# EAGLE design HbHandBoardMk2_V4 (EAGLE 8.3.2)
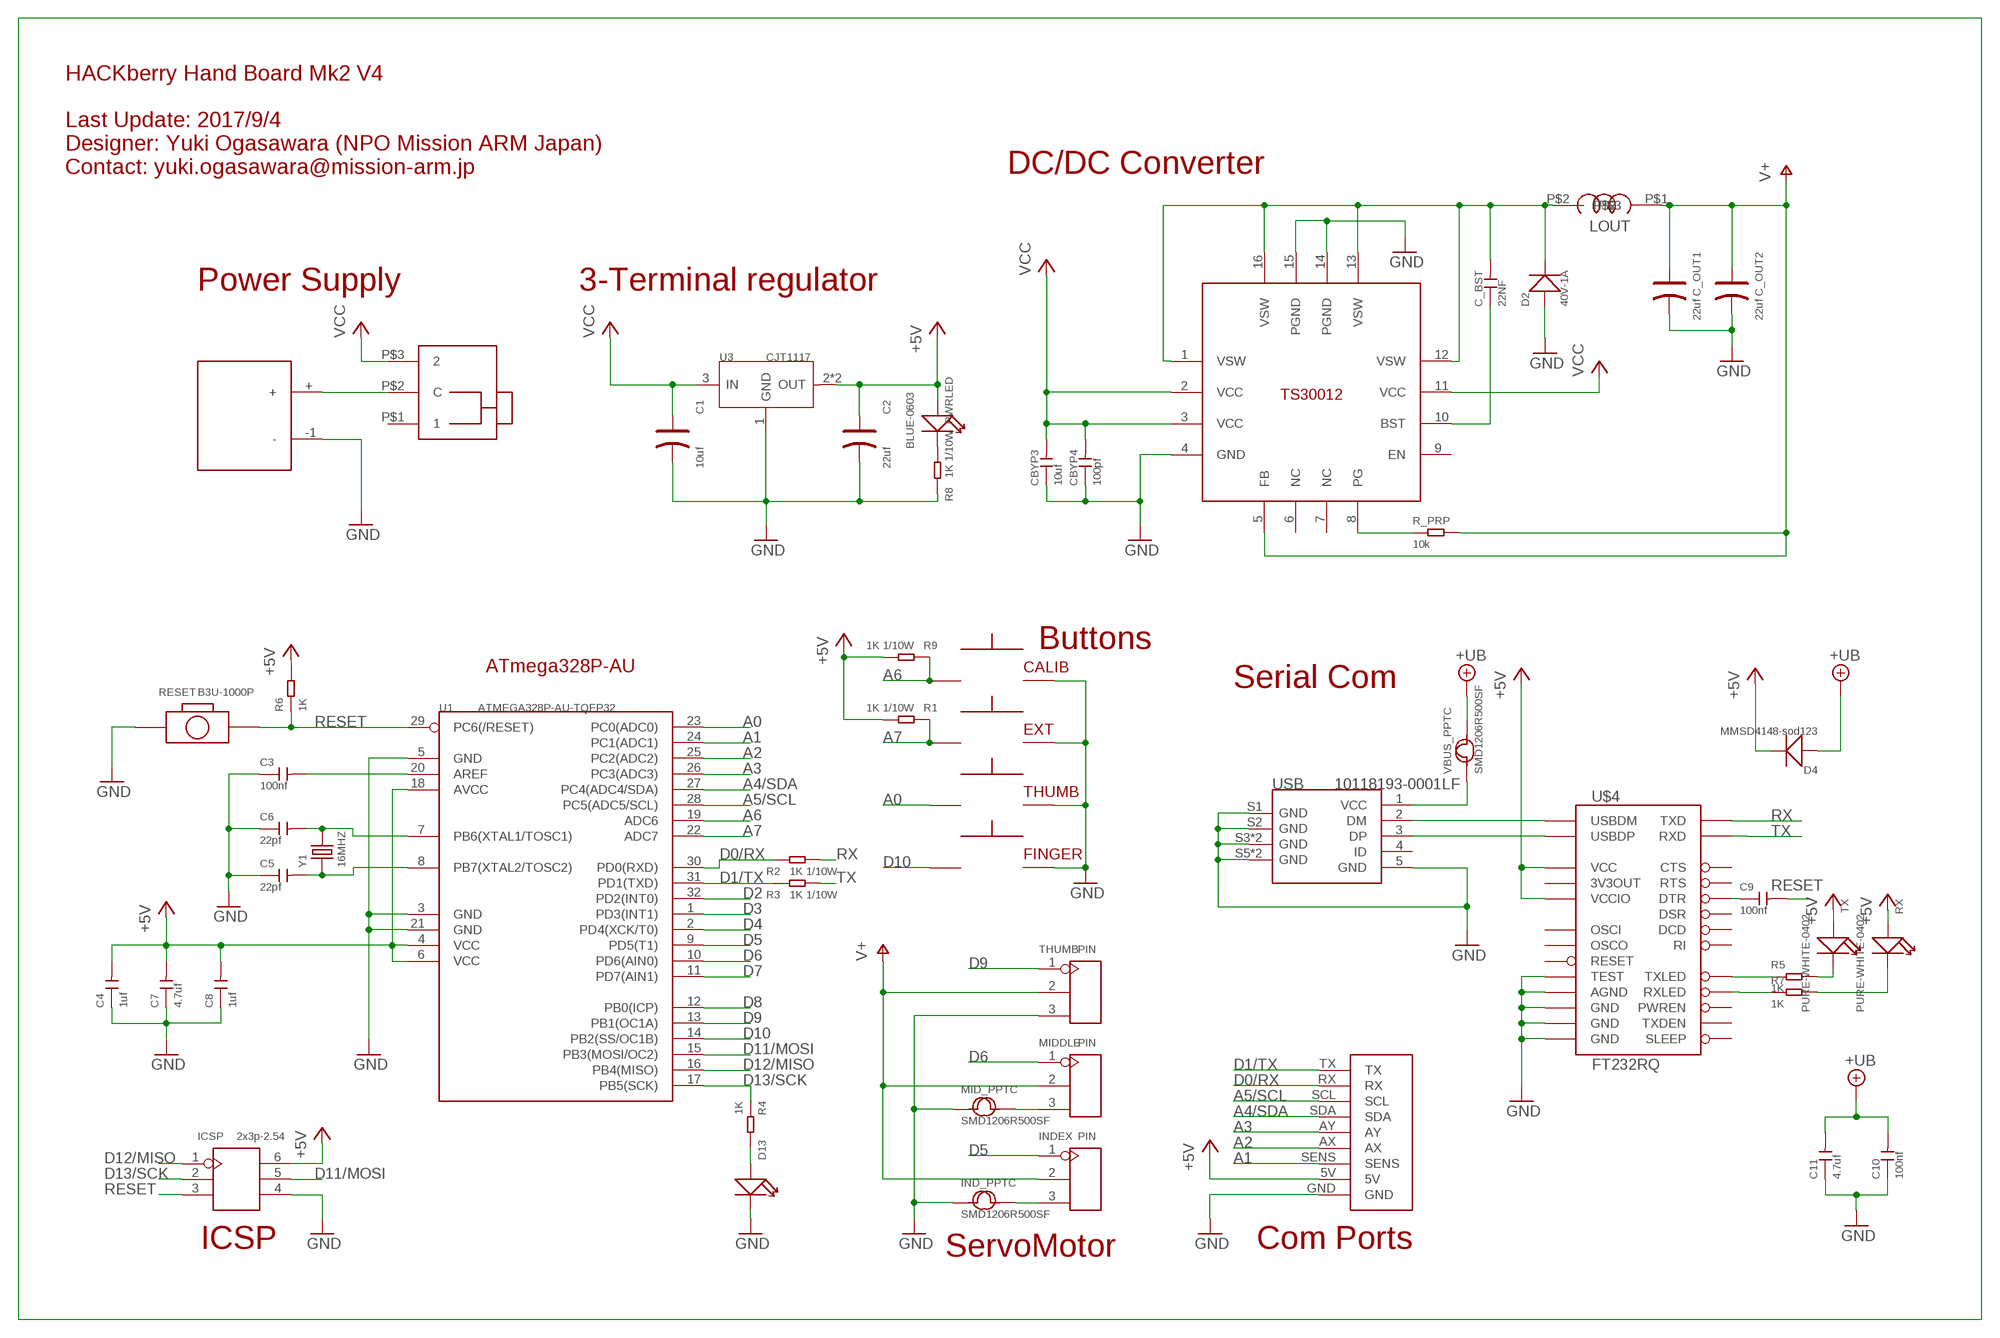
[diagram p0: schematic, sheet 1]

## Parts
C1  10uf  TANTALUM-SMD-10UF-10V-10%(AVX-A)  [AVX-A]
C2  22uf  TANTALUM-SMD-22UF-10V(AVX-A)  [AVX-A]
C3  100nf  CERAMIC-100NF-25V-10%-X7R(0402)  [C0402]
C4  1uf  CERAMIC-1UF-10V-10%-X5R(0402)  [C0402]
C5  22pf  CERAMIC-22PF-50V-5%-NPO(0402)  [C0402]
C6  22pf  CERAMIC-22PF-50V-5%-NPO(0402)  [C0402]
C7  4.7uf  CERAMIC-4.7UF-10V-10%-X5R(0603)  [C0603]
C8  1uf  CERAMIC-1UF-10V-10%-X5R(0402)  [C0402]
C9  100nf  CERAMIC-100NF-25V-10%-X7R(0402)  [C0402]
C10  100nf  CERAMIC-100NF-25V-10%-X7R(0402)  [C0402]
C11  4.7uf  CERAMIC-4.7UF-10V-10%-X5R(0603)  [C0603]
C_BST  22NF  CERAMIC-22NF-50V-10%-X7R(0402)  [C0402]
C_OUT1  22uf  TANTALUM-SMD-22UF-10V-10%(AVX-B)  [AVX-B]
C_OUT2  22uf  TANTALUM-SMD-22UF-10V-10%(AVX-B)  [AVX-B]
CALIB  SKRGAQD010  [SKRGAQD010]
CBYP3  10uf  CERAMIC-10UF-25V-10%-X5R(0805)  [C0805]
CBYP4  100pf  CERAMIC-100PF-50V-5%-NPO(0402)  [C0402]
D2  40V-1A  SMD-DIODE-SCHOTTKY-40V-1A(DO-214AC)  [DO-214AC]
D4  MMSD4148-sod123  SMD-DIODE-100V-200MA(SOD-123)  [SOD-123]
D13  SMD-LED-CLEAR-GREEN(0805)  [LED-0805]
EXT  SKRGAQD010  [SKRGAQD010]
FINGER  SKRGAQD010  [SKRGAQD010]
ICSP  2x3p-2.54  DIP-BLACK-MALE-HEADER(2X3P-2.54）-2.54  [H2X3-2.54]
IND_PPTC  SMD1206R500SF  SMD-PPTC-500MA(1206)  [F1206]
INDEX  PIN  DIP-BLACK-FEMALE-HEADER-VERT(3P-2.54)  [H3-2.54]
LOUT  SPM3015T-4R7M-LR  [SPM3015T-4R7M-LR]
MID_PPTC  SMD1206R500SF  SMD-PPTC-500MA(1206)  [F1206]
MIDDLE  PIN  DIP-BLACK-FEMALE-HEADER-VERT(3P-2.54)  [H3-2.54]
PWR_SW  SS12SDP2  [SS12SDP2]
PWRLED  BLUE-0603  SMD-LED-CLEAR-BLUE(0603)  [LED-0603]
R1  1K 1/10W  SMD-RES-1K-5%-1/10W(0603)  [R0603]
R2  1K 1/10W  SMD-RES-1K-5%-1/10W(0603)  [R0603]
R3  1K 1/10W  SMD-RES-1K-5%-1/10W(0603)  [R0603]
R4  1K  SMD-RES-1K-5%-1/8W(0805)  [R0805]
R5  1K  SMD-RES-1K-5%-1/16W(0402)  [R0402]
R6  1K  SMD-RES-1K-5%-1/16W(0402)  [R0402]
R7  1K  SMD-RES-1K-5%-1/16W(0402)  [R0402]
R8  1K 1/10W  SMD-RES-1K-5%-1/10W(0603)  [R0603]
R9  1K 1/10W  SMD-RES-1K-5%-1/10W(0603)  [R0603]
R_PRP  10k  RES-0402  [R0402]
RESET  B3U-1000P  SMD-BUTTON-WITHOUT-BOSS-(2P-3X2.5MM)  [SW2-SMD-3.0X2.5X1.2+0.4MM]
RX  PURE-WHITE-0402  SMD-LED-YELLOW-DIFFUSED-PURE-WHITE(0402)  [LED-0402]
THUMB  PIN  DIP-BLACK-FEMALE-HEADER-VERT(3P-2.54)  [H3-2.54]
THUMB_BUTTON  SKRGAQD010  [SKRGAQD010]
TX  PURE-WHITE-0402  SMD-LED-YELLOW-DIFFUSED-PURE-WHITE(0402)  [LED-0402]
U1  ATMEGA328P-AU-TQFP32  MCU-ATMEGA328P-AU(TQFP32)  [TQFP32-0.8-7X7MM]
U3  CJT1117  PMIC-CJT1117-5.0(SOT223)  [SOT-223]
U$1  9PADS  [9PADS]
U$3  DCJACK  [DCJ3P-14.2X11.0X9.0MM]
U$4  FT232RQ  [QFN-32]
U$6  TS30012  [VQFN16]
USB  10118193-0001LF  MICRO-USB-SMD-B-(10118193-0001LF)  [MICRO-USB5+6P-SMD-0.65-B]
VBUS_PPTC  SMD1206R500SF  SMD-PPTC-500MA(1206)  [F1206]
Y1  16MHZ  SMD-CRYSTAL-16MHZ-8PF-20PPM-40R(2P-5.0X3.2MM)  [X2-SMD-5.0X3.2X1.3MM]

## Nets
+5V [MCPower]: C2.+ C4.2 C7.2 C8.2 D4.- ICSP.6 PWRLED.+ R1.2 R6.2 R9.2 RX.+ TX.+ U1.4(VCC) U1.6(VCC) U1.18(AVCC) U3.2(OUT) U3.TER(OUT) U$1.5V U$4.1(VCCIO) U$4.19(VCC)
+UB [Power]: C10.2 C11.2 D4.+ VBUS_PPTC.2
A0: THUMB_BUTTON.P$1 U1.23(PC0(ADC0))
A1: U1.24(PC1(ADC1)) U$1.SENS
A2: U1.25(PC2(ADC2)) U$1.AX
A3: U1.26(PC3(ADC3)) U$1.AY
A4/SDA: U1.27(PC4(ADC4/SDA)) U$1.SDA
A5/SCL: U1.28(PC5(ADC5/SCL)) U$1.SCL
A6: CALIB.P$1 R9.1 U1.19(ADC6)
A7: EXT.P$1 R1.1 U1.22(ADC7)
D0/RX: R2.1 U1.30(PD0(RXD)) U$1.RX
D1/TX: R3.1 U1.31(PD1(TXD)) U$1.TX
D2: U1.32(PD2(INT0))
D3: U1.1(PD3(INT1))
D4: U1.2(PD4(XCK/T0))
D5: INDEX.1 U1.9(PD5(T1))
D6: MIDDLE.1 U1.10(PD6(AIN0))
D7: U1.11(PD7(AIN1))
D8: U1.12(PB0(ICP))
D9: THUMB.1 U1.13(PB1(OC1A))
D10: FINGER.P$1 U1.14(PB2(SS/OC1B))
D11/MOSI: ICSP.5 U1.15(PB3(MOSI/OC2))
D12/MISO: ICSP.1 U1.16(PB4(MISO))
D13/SCK: ICSP.2 R4.1 U1.17(PB5(SCK))
GND [GND]: C1.- C2.- C3.1 C4.1 C5.1 C6.1 C7.1 C8.1 C10.1 C11.1 C_OUT1.- C_OUT2.- CALIB.P$2 CBYP3.1 CBYP4.1 D2.1(+) D13.- EXT.P$2 FINGER.P$2 ICSP.4 IND_PPTC.1 MID_PPTC.1 R8.1 RESET.1 THUMB.3 THUMB_BUTTON.P$2 U1.3(GND) U1.5(GND) U1.21(GND) U3.1(GND) U$1.GND U$3.-1(-) U$4.4(GND) U$4.17(GND) U$4.20(GND) U$4.24(AGND) U$4.26(TEST) U$6.4(GND) U$6.14(PGND) U$6.15(PGND) USB.5(GND) USB.S1(GND) USB.S2(GND) USB.S3(GND) USB.S4(GND) USB.S5(GND) USB.S6(GND)
N$1: PWRLED.- R8.2
N$2: C5.2 U1.8(PB7(XTAL2/TOSC2)) Y1.1
N$3: C6.2 U1.7(PB6(XTAL1/TOSC1)) Y1.2
N$4: D13.+ R4.2
N$6: U$4.15(USBDM) USB.2(DM)
N$7: C3.2 U1.20(AREF)
N$8: U$4.14(USBDP) USB.3(DP)
N$11 [Power]: C_BST.2 D2.2(-) LOUT.P$2 U$6.1(VSW) U$6.12(VSW) U$6.13(VSW) U$6.16(VSW)
N$12 [Power]: PWR_SW.P$2(C) U$3.+
N$13 [GND]: C_BST.1 U$6.10(BST)
N$14 [GND]: IND_PPTC.2 INDEX.3
N$15 [GND]: MID_PPTC.2 MIDDLE.3
N$17: R_PRP.1 U$6.8(PG)
N$21: C9.1 U$4.31(DTR)
N$24: USB.1(VCC) VBUS_PPTC.1
N$25: R5.1 U$4.22(TXLED)
N$27: R7.1 U$4.21(RXLED)
N$28: R5.2 TX.-
N$29: R7.2 RX.-
RESET: C9.2 ICSP.3 R6.1 RESET.2 U1.29(PC6(/RESET))
RX: R2.2 U$4.30(TXD)
TX: R3.2 U$4.2(RXD)
V+ [Power]: C_OUT1.+ C_OUT2.+ INDEX.2 LOUT.P$1 MIDDLE.2 R_PRP.2 THUMB.2 U$6.5(FB)
VCC: C1.+ CBYP3.2 CBYP4.2 PWR_SW.P$3 U3.3(IN) U$6.2(VCC) U$6.3(VCC) U$6.11(VCC)
Unconnected: PWR_SW.P$1 U$4.3(RI) U$4.6(DSR) U$4.7(DCD) U$4.8(CTS) U$4.9(SLEEP) U$4.10(TXDEN) U$4.11(PWREN) U$4.16(3V3OUT) U$4.18(RESET) U$4.27(OSCI) U$4.28(OSCO) U$4.32(RTS) U$6.6(NC) U$6.7(NC) U$6.9(EN) USB.4(ID)

## Notes on the sheet
- HACKberry Hand Board Mk2 V4
  
  Last Update: 2017/9/4
  Designer: Yuki Ogasawara (NPO Mission ARM Japan)
  Contact: yuki.ogasawara@mission-arm.jp
- DC/DC Converter
- Power Supply | 3-Terminal regulator
- Buttons
- ATmega328P-AU | CALIB
- Serial Com
- EXT
- THUMB
- FINGER
- ICSP | ServoMotor | Com Ports

## Library data of the parts
C1 = Seeed-OPL-Capacitor:TANTALUM-SMD-10UF-10V-10%(AVX-A): 302020011; MPN: TAJA106K010RNJ
C2 = Seeed-OPL-Capacitor:TANTALUM-SMD-22UF-10V(AVX-A): 302020008; MPN: TAJA226*010#NJ
C3 C9 C10 = Seeed-OPL-Capacitor:CERAMIC-100NF-25V-10%-X7R(0402): 302010024; MPN: CC0402KRX7R8BB104
C4 C8 = Seeed-OPL-Capacitor:CERAMIC-1UF-10V-10%-X5R(0402): 302010040; MPN: CC0402KRX5R6BB105
C5 C6 = Seeed-OPL-Capacitor:CERAMIC-22PF-50V-5%-NPO(0402): 302010018; MPN: CC0402JRNPO9BN220
C7 C11 = Seeed-OPL-Capacitor:CERAMIC-4.7UF-10V-10%-X5R(0603): 302010111; MPN: CC0603KRX5R6BB475
C_BST = Seeed-OPL-Capacitor:CERAMIC-22NF-50V-10%-X7R(0402): 302010242; MPN: CC0402KRX7R9BB223; VALUE: 22NF 50V
C_OUT1 C_OUT2 = Seeed-OPL-Capacitor:TANTALUM-SMD-22UF-10V-10%(AVX-B): 302020021; MPN: TAJB226K010RNJ
CALIB EXT FINGER THUMB_BUTTON = HbHandBoardMk2_V4:SKRGAQD010
CBYP3 = Seeed-OPL-Capacitor:CERAMIC-10UF-25V-10%-X5R(0805): 302010178; MPN: CC0805KKX5R8BB106
CBYP4 = Seeed-OPL-Capacitor:CERAMIC-100PF-50V-5%-NPO(0402): 302010012; MPN: CC0402JRNPO9BN101
D2 = Seeed-OPL-Diode:SMD-DIODE-SCHOTTKY-40V-1A(DO-214AC): 304020027; MPN: 1N5819
D4 = Seeed-OPL-Diode:SMD-DIODE-100V-200MA(SOD-123): 304010007; MPN: MMSD4148
D13 = Seeed-OPL-Diode:SMD-LED-CLEAR-GREEN(0805): 304090057; MPN: 17-215SYGC/S530-E2/TR8; VALUE: GREEN-0805
ICSP = Seeed-OPL-Connector:DIP-BLACK-MALE-HEADER(2X3P-2.54）: 320020077; MPN: P125-12A1BS116A1
IND_PPTC MID_PPTC VBUS_PPTC = Seeed-OPL-fuse:SMD-PPTC-500MA(1206): 307010002; MPN: SMD1206R500SF
INDEX MIDDLE THUMB = Seeed-OPL-Connector:DIP-BLACK-FEMALE-HEADER-VERT(3P-2.54): 320030024; MPN: F185-1103A0BSYA1; VALUE: 3p-2.54
LOUT = HbHandBoardMk2_V4:SPM3015T-4R7M-LR
PWR_SW = HbHandBoardMk2_V4:SS12SDP2: SPDT ON-OFF-ON Switch Manufacturer: NKK Switches Part Number: SS12SDP2
PWRLED = Seeed-OPL-Diode:SMD-LED-CLEAR-BLUE(0603): 304090045; MPN: 19-217-BHC-ZL1M2RY-3T
R1-R3 R8 R9 = Seeed-OPL-Resistor:SMD-RES-1K-5%-1/10W(0603): 301010291; MPN: RC0603JR-071KL
R4 = Seeed-OPL-Resistor:SMD-RES-1K-5%-1/8W(0805): 301010311; MPN: RC0805JR-071KL
R5-R7 = Seeed-OPL-Resistor:SMD-RES-1K-5%-1/16W(0402): 301010006; MPN: RC0402JR-071KL
R_PRP = Seeed-OPL-Resistor:RES
RESET = Seeed-OPL-Button:SMD-BUTTON-WITHOUT-BOSS-(2P-3X2.5MM): 311020047; MPN: B3U-1000P
RX TX = Seeed-OPL-Diode:SMD-LED-YELLOW-DIFFUSED-PURE-WHITE(0402): 304090016; MPN: 16-219A/T2D-AR2T1QY/3T
U1 = Seeed-OPL-ic:MCU-ATMEGA328P-AU(TQFP32): 310010049; MPN: ATMEGA328P-AU
U3 = Seeed-OPL-ic:PMIC-CJT1117-5.0(SOT223): 310030096; MPN: CJT1117-5.0; VALUE: CJT1117-5.0-SOT223
U$1 = HbHandBoardMk2_V4:9PADS
U$3 = HbHandBoardMk2_V4:DCJACK
U$4 = HbHandBoardMk2_V4:FT232RQ: USB to USART. Non-stock item, unproven FP for this part.; AVAILABILITY: Good; DESCRIPTION: Interface; USB-UART; Full Speed; QFN32; MF: FTDI; MP: FT232RQ; PACKAGE: QFN-32 FTDI; PRICE: 6.55 USD
U$6 = HbHandBoardMk2_V4:TS30012
USB = Seeed-OPL-Connector:MICRO-USB-SMD-B-(10118193-0001LF): 320010003; MPN: 10118193-0001LF
Y1 = Seeed-OPL-Crystal-Oscillator:SMD-CRYSTAL-16MHZ-8PF-20PPM-40R(2P-5.0X3.2MM): 306010054; MPN: X053201602002

## Net classes
0 default: width 0.305 mm, clearance 0.152 mm
1 MCPower: clearance 0.152 mm
2 Power: clearance 0.152 mm
3 GND: clearance 0.152 mm

## Board
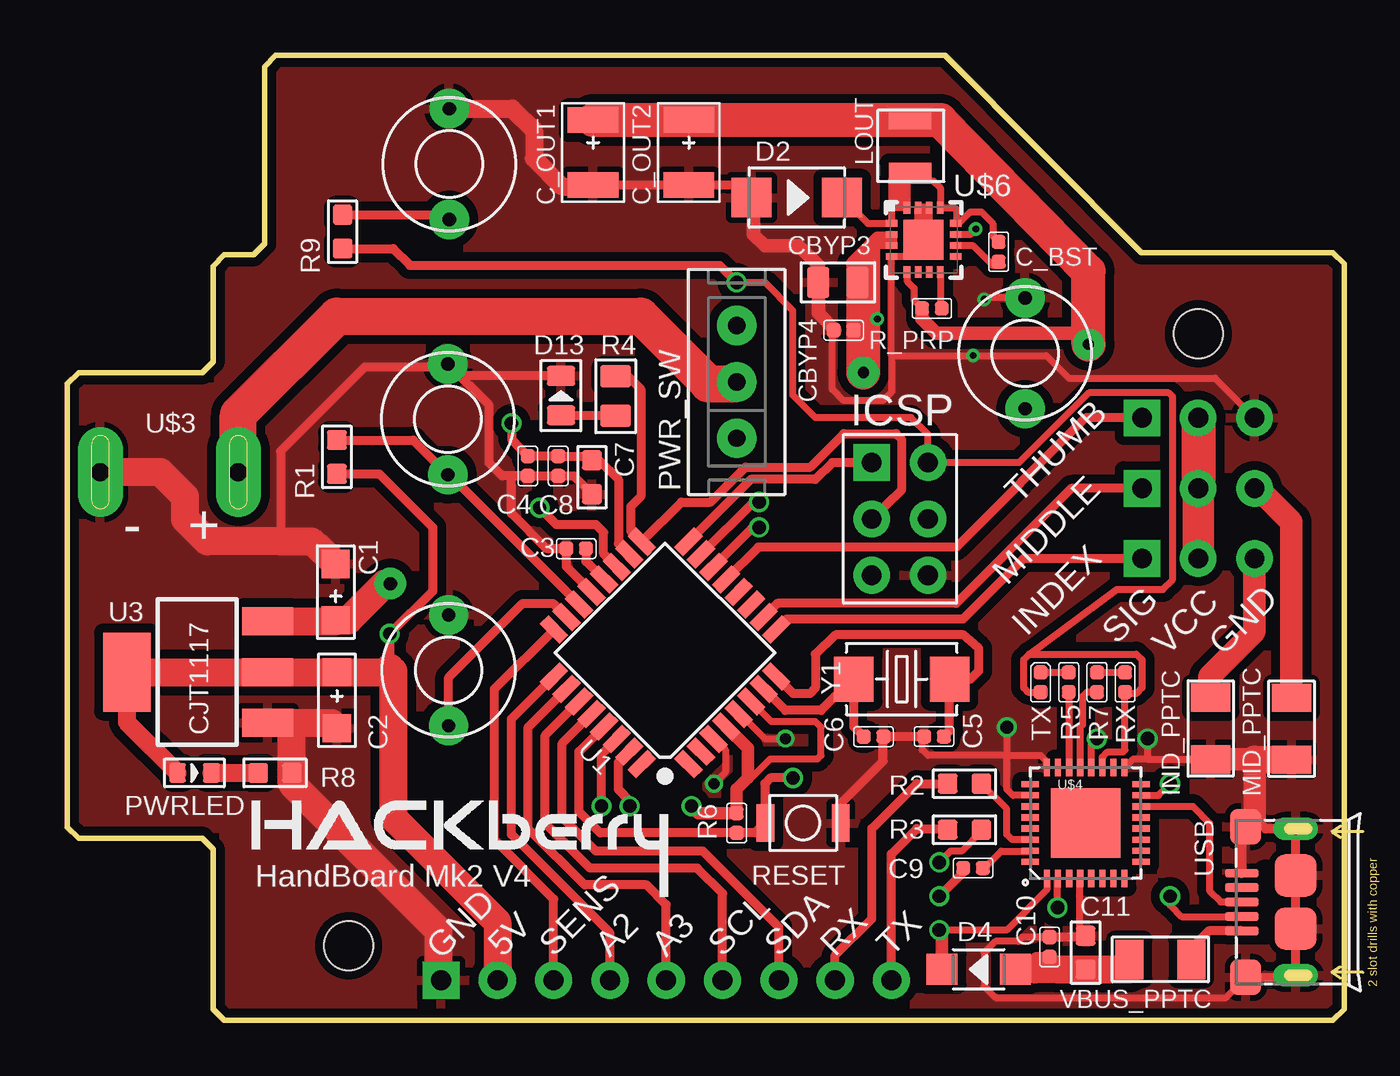
[diagram p1: board, top side]
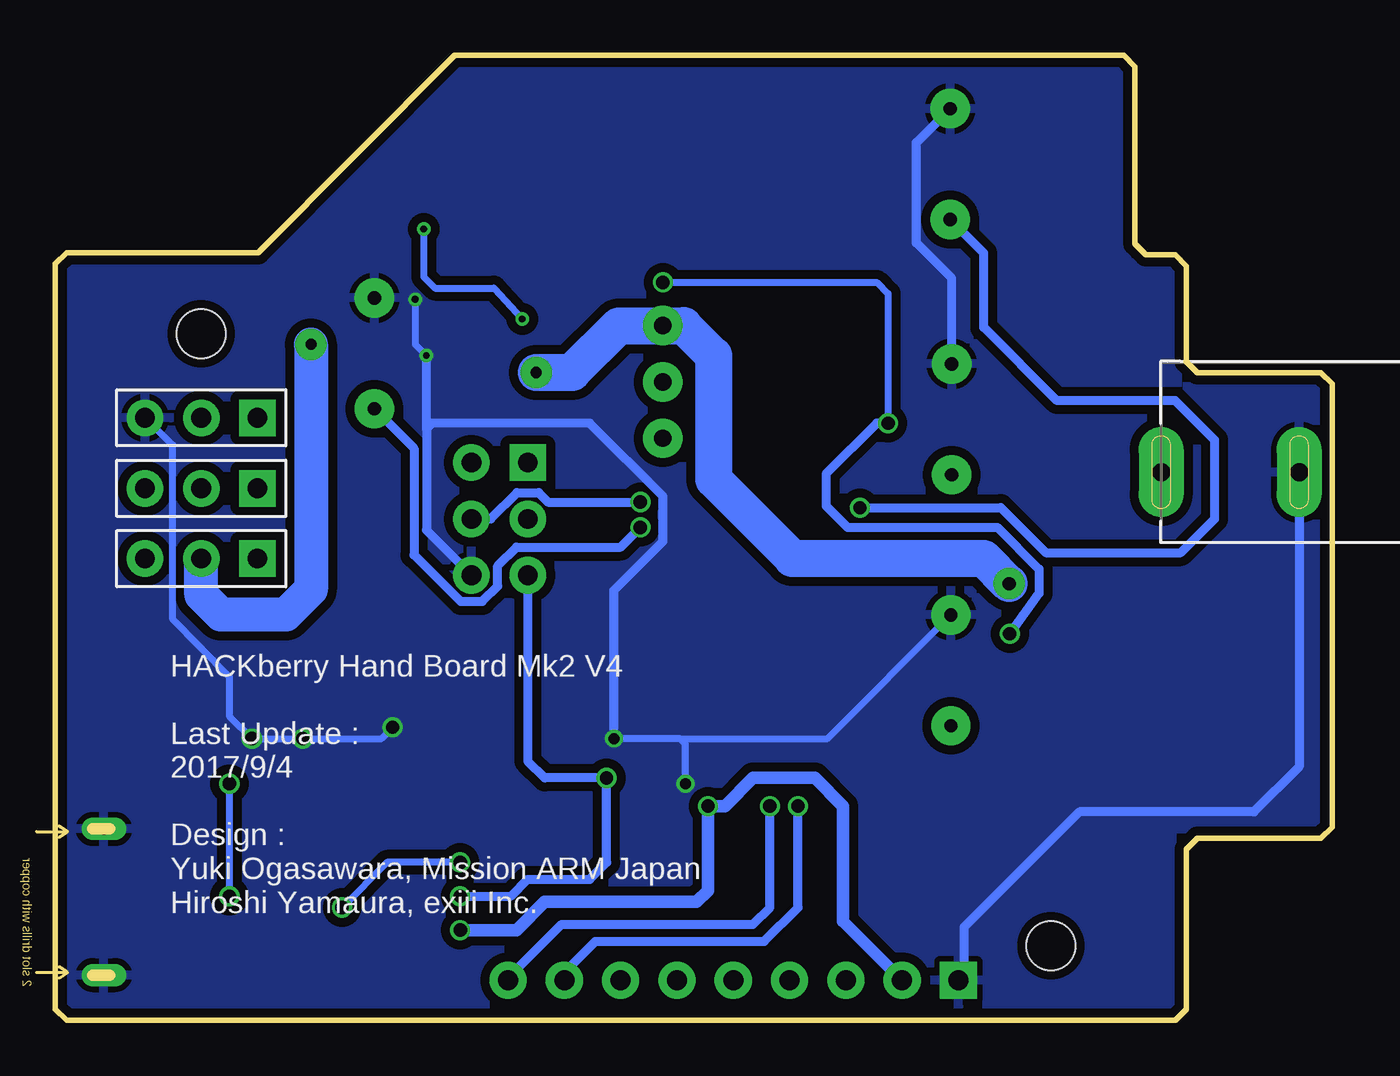
[diagram p2: board, bottom side, seen from below]

Size 57.6 x 43.51 mm. Coordinates in mm from the lower left corner, seen from the top.
Outline: 57.6,0.5 57.6,34.12 57.1,34.62 48.45,34.62 39.59,43.51 9.4,43.51 8.9,43.01 8.9,35.01 8.4,34.51 7.07,34.51 6.57,34.01 6.57,29.7 6.09,29.2 0.5,29.2 0,28.7 0,8.7 0.5,8.2 6.07,8.2 6.57,7.7 6.57,0.5 7.07,0 57.1,0 57.6,0.5
Copper layers (1*16): Top 0.035mm / dielectric 1.5mm / Bottom 0.035mm
Design rules "SeeedStudio_2layer_DRU_no_angle_20140221": minimum track width 6mil, minimum drill 12mil, track to track 6mil, track to pad 6mil, pad to pad 6mil, via to via 6mil, smd to smd 0mil, copper to edge 10mil, drill to drill 10mil, minimum pad ring 10mil, minimum via ring 6mil, stop-mask expansion 2mil, vias tented up to drill 100mil, thermal gap 10mil
Holes 2.2 mm at 12.69,3.35 51.02,30.96

### Footprints (pad centres in the part's own frame; a part is rotated, then mirrored left to right if it is on the bottom)
AVX-A = smd 1.27 x 1.27: + -1.27,0; - 1.27,0
C0402 = smd 0.635 x 0.635: 1 0,0.445; 2 0,-0.445
C0603 = smd 0.889 x 0.889: 1 0,0.762; 2 0,-0.762
AVX-B = smd 1.143 x 2.286: + -1.46,0; - 1.46,0
SKRGAQD010 = drill 0.6 pad 1.778: P$1 -2.5,0; P$2 2.5,0
C0805 = smd 1.397 x 1.016: 1 0,0.889; 2 0,-0.889
DO-214AC = smd 1.8 x 1.77: 1 -2.042,0; 2 2.042,0
SOD-123 = smd 1.397 x 1.397: + -1.651,0; - 1.651,0
LED-0805 = smd 0.889 x 1.27: + -0.889,0; - 0.889,0
H2X3-2.54 = drill 0.889 pad 1.651 square: 1 -1.27,2.54 | drill 0.889 pad 1.651: 2 -1.27,0; 3 -1.27,-2.54; 4 1.27,-2.54; 5 1.27,0; 6 1.27,2.54
F1206 = smd 1.27 x 1.778: 1 -1.397,0; 2 1.397,0
H3-2.54 = drill 0.889 pad 1.651 square: 1 0,2.54 | drill 0.889 pad 1.651: 2 0,0; 3 0,-2.54
SPM3015T-4R7M-LR = smd 0.965 x 1.93: P$1 0.49,0.97; P$2 2.95,0.97
SS12SDP2 = drill 0.787 pad 1.778: P$1 0,2.54; P$2 0,0; P$3 0,-2.54
LED-0603 = smd 0.762 x 0.889: + -0.762,0; - 0.762,0
R0603 = smd 0.889 x 0.889: 1 0,0.762; 2 0,-0.762
R0805 = smd 1.397 x 1.016: 1 0,0.889; 2 0,-0.889
R0402 = smd 0.635 x 0.635: 1 0,0.445; 2 0,-0.445
SW2-SMD-3.0X2.5X1.2+0.4MM = smd 0.8 x 1.7: 1 -1.7,0; 2 1.7,0
LED-0402 = smd 0.635 x 0.635: + -0.445,0; - 0.445,0
TQFP32-0.8-7X7MM = smd 1.27 x 0.559: 1 -4.293,2.8; 2 -4.293,2; 3 -4.293,1.2; 4 -4.293,0.4; 5 -4.293,-0.4; 6 -4.293,-1.2; 7 -4.293,-2; 8 -4.293,-2.8; 17 4.293,-2.8; 18 4.293,-2; 19 4.293,-1.2; 20 4.293,-0.4; 21 4.293,0.4; 22 4.293,1.2; 23 4.293,2; 24 4.293,2.8 | smd 0.559 x 1.27: 9 -2.8,-4.293; 10 -2,-4.293; 11 -1.2,-4.293; 12 -0.4,-4.293; 13 0.4,-4.293; 14 1.2,-4.293; 15 2,-4.293; 16 2.8,-4.293; 25 2.8,4.293; 26 2,4.293; 27 1.2,4.293; 28 0.4,4.293; 29 -0.4,4.293; 30 -1.2,4.293; 31 -2,4.293; 32 -2.8,4.293
SOT-223 = smd 1.27 x 2.286: 1 -2.286,-3.175; 2 0,-3.175; 3 2.286,-3.175 | smd 3.556 x 2.159: TER 0,3.175
9PADS = drill 0.9 pad 1.676: 5V 2.54,0; AX 7.62,0; AY 10.16,0; RX 17.78,0; SCL 15.24,0; SDA 12.7,0; SENS 5.08,0; TX 20.32,0 | drill 0.9 pad 1.676 square: GND 0,0
DCJ3P-14.2X11.0X9.0MM = drill 0.813 pad 2.032 long: + 3.175,0; -1 -3.048,0
QFN-32 = smd 0.285 x 0.8: 1 -1.75,-2.5; 2 -1.25,-2.5; 3 -0.75,-2.5; 4 -0.25,-2.5; 5 0.25,-2.5; 6 0.75,-2.5; 7 1.25,-2.5; 8 1.75,-2.5; 17 1.75,2.5; 18 1.25,2.5; 19 0.75,2.5; 20 0.25,2.5; 21 -0.25,2.5; 22 -0.75,2.5; 23 -1.25,2.5; 24 -1.75,2.5 | smd 0.8 x 0.285: 9 2.5,-1.75; 10 2.5,-1.25; 11 2.5,-0.75; 12 2.5,-0.25; 13 2.5,0.25; 14 2.5,0.75; 15 2.5,1.25; 16 2.5,1.75; 25 -2.5,1.75; 26 -2.5,1.25; 27 -2.5,0.75; 28 -2.5,0.25; 29 -2.5,-0.25; 30 -2.5,-0.75; 31 -2.5,-1.25; 32 -2.5,-1.75 | smd 3.15 x 3.15: EP 0,0
VQFN16 = smd 0.52 x 0.3: 1 -1.45,0.75; 2 -1.45,0.25; 3 -1.45,-0.25; 4 -1.45,-0.75; 9 1.45,-0.75; 10 1.45,-0.25; 11 1.45,0.25; 12 1.45,0.75 | smd 0.3 x 0.52: 5 -0.75,-1.45; 6 -0.25,-1.45; 7 0.25,-1.45; 8 0.75,-1.45; 13 0.75,1.45; 14 0.25,1.45; 15 -0.25,1.45; 16 -0.75,1.45 | smd 1.8 x 1.8: 17 0,0
MICRO-USB5+6P-SMD-0.65-B = smd 0.4 x 1.5: 1 -1.3,-0.25; 2 -0.65,-0.25; 3 0,-0.25; 4 0.65,-0.25; 5 1.3,-0.25 | smd 1.6 x 1.4: S1 -3.4,-0.427; S6 3.4,-0.427 | drill 0.508 pad 1.016 long: S2 -3.3,-2.675; S5 3.3,-2.675 | smd 1.9 x 1.9: S3 -1.2,-2.675; S4 1.2,-2.675
X2-SMD-5.0X3.2X1.3MM = smd 1.778 x 2.032: 1 -2.159,0; 2 2.159,0

### Placement (x,y rotation side)
C1  12.11,19.3 90 top
C2  12.16,14.43 270 top
C3  22.95,21.26 90 top
C4  20.77,24.99 180 top
C5  39.1,12.79 90 top
C6  36.37,12.79 270 top
C7  23.66,24.49 180 top
C8  22.14,24.99 180 top
C9  40.86,6.86 270 top
C10  44.31,3.3 0 top
C11  45.94,3.05 0 top
C_BST  42.01,34.66 180 top
C_OUT1  23.71,39.13 270 top
C_OUT2  28.03,39.13 270 top
CALIB  17.23,38.61 90 top
CBYP3  34.76,33.27 90 top
CBYP4  35.02,31.11 90 top
D2  32.91,37.1 0 top
D4  41.11,2.29 180 top
D13  22.27,28.17 90 top
EXT  17.16,27.1 90 top
FINGER  43.21,30.08 90 top
ICSP  37.56,22.61 0 top
IND_PPTC  51.58,13.16 90 top
INDEX  51.02,20.82 270 bottom
LOUT  37.05,41.15 270 top
MID_PPTC  55.23,13.14 90 top
MIDDLE  51.02,23.98 270 bottom
PWR_SW  30.2,28.78 180 top
PWRLED  5.73,11.15 0 top
R1  12.16,25.4 0 top
R2  40.48,10.67 90 top
R3  40.48,8.59 90 top
R4  24.73,28.14 0 top
R5  45.18,15.24 180 top
R6  30.19,8.89 180 top
R7  46.45,15.24 180 top
R8  9.36,11.15 270 top
R9  12.41,35.56 0 top
R_PRP  39,32.1 270 top
RESET  33.19,8.89 180 top
RX  47.72,15.24 90 top
THUMB  51.02,27.16 270 bottom
THUMB_BUTTON  17.2,15.78 90 top
TX  43.91,15.24 90 top
U1  26.97,16.56 135 top
U3  5.86,15.7 90 top
U$1  16.86,1.8 0 top
U$3  4.54,24.71 180 bottom
U$4  45.94,8.89 0 top
U$6  38.63,35.19 0 top
USB  52.73,5.33 90 top
VBUS_PPTC  49.3,2.74 180 top
Y1  37.64,15.38 180 top

### Tracks (layer width: path | path; a pad name or v marks a point on that pad's centre or on a via)
+5V  (via drill 0.6)
  Top 0.305: U$4.1 44.19,5.87 42.38,4.06 v39.34,4.06 | 43.4,16.51 43.15,16.26 43.15,14.99 43.34,14.8 TX.+ | 43.4,16.51 48.23,16.51 48.48,16.26 48.48,14.99 48.23,14.73 47.78,14.73 RX.+ 47.72,12.19 47.62,12.1 46.92,12.1 46.69,11.86 U$4.19 | 43.4,16.51 47.34,19.43 49.43,19.43 49.86,19.86 49.86,28.12 49.69,28.3 46.09,28.3 42.94,25.15 ICSP.6 38.83,26.42 38.07,27.18 33.75,27.18 32.73,28.19 32.73,32 31.46,33.27 v30.19,33.27 | 30.7,10.92 30.85,10.92 31.72,11.79 33.85,11.79 34,11.94 34,13.21 33.75,13.46 31.76,13.46 U1.6
  Top 0.406: U1.18 24.86,21.5 24.86,24.38 23.99,25.25 C7.2 23.45,25.44 C8.2 C4.2 20.06,26.19 v20.03,26.92 | 14.7,15.75 14.55,15.9 v14.55,17.42 16.48,19.36 16.48,22.23 14.06,24.64 R1.2 | R9.2 14.7,34.8 15.46,34.04 29.43,34.04 v30.19,33.27
  Top 0.559: U1.4 30.7,12.26 30.7,10.92 30.19,10.41 R6.2 28.48,9.34 v28.16,9.65 | D4.- 39.46,3.94 v39.34,4.06
  Top 0.813: PWRLED.+ 2.68,13.44 U3.TER
  Top 1.27: U3.TER U3.2 C2.+ 14.34,15.7 14.55,15.9 | 14.7,15.75 14.7,9.12 19.4,4.42 U$1.5V
  Bottom 0.305: v30.19,33.27 20.54,33.27 20.03,32.77 v20.03,26.92
  Bottom 0.406: v20.03,26.92 20.54,26.92 22.83,24.64 22.83,23.19 21.86,22.23 15.1,22.23 13.23,20.34 13.23,19.25 v14.55,17.42
  Bottom 0.559: U$1.5V 22.06,4.47 22.06,9.65 23.33,10.92 26.13,10.92 27.4,9.65 v28.16,9.65 28.16,5.84 28.67,5.33 35.53,5.33 36.8,4.06 v39.34,4.06
+UB
  Top 0.406: C10.2 43.65,2.86 43.65,2.29 | C11.2 44.67,2.29
  Top 1.27: D4.+ 43.65,2.29 44.67,2.29 47.91,2.29 VBUS_PPTC.2
A0
  Top 0.406: THUMB_BUTTON.P$1 17.2,15.45 20.54,18.8 21.9,18.8 U1.23
A1
  Top 0.406: U$1.SENS 21.94,5.46 19.27,8.13 19.27,14.94 U1.24
A2
  Top 0.406: U$1.AX 24.48,3.94 20.03,8.38 20.03,13.59 U1.25
A3
  Top 0.406: U$1.AY 27.02,5.21 26.13,6.1 23.33,6.1 20.79,8.64 20.79,13.22 U1.26
A4/SDA
  Top 0.406: U$1.SDA 29.56,5.71 28.41,6.86 23.59,6.86 21.56,8.89 21.56,12.85 U1.27
A5/SCL
  Top 0.406: U$1.SCL 32.1,4.19 28.67,7.62 23.84,7.62 22.32,9.14 22.32,12.48 U1.28
A6  (via drill 0.6)
  Top 0.406: U1.19 24.2,21.03 24.2,22 23.84,22.35 22.06,22.35 v21.3,23.11 | R9.1 17.01,36.32 CALIB.P$1
  Bottom 0.406: v21.3,23.11 14.95,23.11 12.92,21.08 6.82,21.08 5.3,22.61 5.3,26.16 7.08,27.94 12.41,27.94 15.71,31.24 15.71,34.59 CALIB.P$1
A7
  Top 0.406: U1.22 17.23,24.6 EXT.P$1 15.6,26.16 R1.1
D0/RX  (via drill 0.6)
  Top 0.406: v24.1,9.65 24.1,11.99 U1.30 | U$1.RX 34.64,2.92 36.29,4.57 36.29,8.64 38.32,10.67 R2.1
  Bottom 0.406: U$1.RX 34.64,2.16 33.24,3.56 25.62,3.56 24.1,5.08 v24.1,9.65
D1/TX  (via drill 0.6)
  Top 0.406: v25.37,9.65 25.37,9.91 24.86,10.41 24.86,11.62 U1.31 | U$1.TX 37.18,7.49 38.32,8.64 39.67,8.64 R3.1
  Bottom 0.406: U$1.TX 37.18,1.91 34.76,4.32 26.13,4.32 25.37,5.08 v25.37,9.65
D5
  Top 0.406: INDEX.1 43.13,20.82 40.4,18.09 32.45,18.09 U1.9
D6
  Top 0.406: MIDDLE.1 45.29,23.98 40.1,18.8 32.03,18.8 U1.10
D9
  Top 0.406: THUMB.1 45.93,27.16 40.1,21.34 31.18,21.34 U1.13
D10  (via drill 0.6)
  Top 0.406: v31.21,22.23 30.93,22.23 U1.14
  Bottom 0.406: FINGER.P$1 41.42,25.79 41.42,20.99 39.32,18.89 38.34,18.89 37.65,19.58 37.65,20.48 36.8,21.34 32.1,21.34 v31.21,22.23
D11/MOSI  (via drill 0.6)
  Top 0.406: v31.21,23.37 30.95,23.37 U1.15
  Bottom 0.406: ICSP.5 37.96,22.61 36.78,23.79 35.8,23.79 35.38,23.37 v31.21,23.37
D12/MISO
  Top 0.406: ICSP.1 34.51,25.15 33.75,24.38 30.83,24.38 U1.16
D13/SCK
  Top 0.406: U1.17 25.5,21.98 | R4.1 25.29,29.03 25.87,28.45 25.87,23.62 25.42,23.16 25.42,22.07 U1.17 | U1.17 27.7,23.37 29.02,23.37 30.6,24.94 33.52,24.94 35.03,26.45 37.39,26.45 37.62,26.22 37.62,23.89 ICSP.2
GND  (via drill 0.3, 0.5, 0.6)
  Top 0.305: U$6.14 U$6.15 38.38,34.44 U$6.4 37.18,29.97 | USB.S6 53.05,8.83 | 37.18,29.97 37.18,28.32 36.8,27.94 35.02,27.94 34.51,28.45 34.51,31.05 CBYP4.1 | FINGER.P$2 41.43,32.58 v41.37,32.51 | 37.18,29.97 v40.86,29.97 44.16,29.97 45.18,28.96 51.77,28.96 THUMB.3 | U$4.4 45.69,3.81 C11.1 | U$4.24 44.19,11.66 43.91,11.94 42.38,11.94 | 42.38,11.94 38.83,11.94 38.57,12.19 38.57,12.71 C5.1 | U$4.26 42.66,10.14 42.38,10.41 42.38,11.94 | U$4.20 46.19,12.44 v46.45,12.7 | 48.73,11.76 IND_PPTC.1 | 48.73,11.76 48.06,11.76 U$4.17 | v48.73,12.7 48.73,11.76 | C10.1 43.08,3.75 42.89,3.56 41.88,3.56 41.37,3.05 41.37,1.52 41.88,1.02 52.25,1.02 USB.S1 | v42.38,13.21 42.38,11.94 | U1.5 30.35,13.81 31.46,12.7 v32.4,12.7 | U1.3 29.2,12.68 29.68,12.19 29.68,11.18 v29.18,10.67
  Top 0.406: 17.2,41.11 CALIB.P$2 | C_OUT1.- C_OUT2.- 30.68,37.67 D2.1 | USB.S1 55.31,1.93 USB.S2 USB.S3 USB.S4 USB.S5 54.07,8.62 53.56,9.13 | USB.5 52.98,8.55 USB.S6 | C10.1 45.69,3.75 C11.1 | C5.1 C6.1 36.8,12.77 36.8,11.68 34.89,9.78 RESET.1 | U1.21 22.51,20.45 C3.1 21.63,21.27 20.03,22.86 20.03,24.52 C4.1 | C4.1 C8.1 22.84,24.55 C7.1 | D13.- 17.7,29.06 EXT.P$2 | C4.1 19.61,24.55 19.02,25.15 19.02,27.74 EXT.P$2 | EXT.P$2 17.03,29.46 13.43,29.46 9.62,25.65 9.62,21.59
  Top 0.61: CBYP4.1 34.64,31.11 33.88,31.88 CBYP3.1 33.88,34.04 32.99,34.92 31.46,34.92 30.95,35.43 30.95,37.02 D2.1
  Top 0.813: CALIB.P$2 20.07,41.11 21.05,40.13 21.05,38.86 22.32,37.59 23.64,37.59 C_OUT1.-
  Top 1.016: IND_PPTC.1 55.22,11.76 MID_PPTC.1 | 53.56,11.76 53.56,9.13 USB.S6
  Top 1.27: 53.56,11.76 MID_PPTC.1 | U$3.-1 4.21,24.71 5.3,23.62 5.3,22.61 6.32,21.59 9.62,21.59 11.02,21.59 C1.- | U$1.GND 16.73,1.93 16.73,4.06 10.13,10.67 R8.1 10.13,13.41 | 10.13,13.41 U3.1 | 10.13,13.41 11.9,13.41 C2.-
  Bottom 0.305: v41.37,32.51 41.37,30.48 v40.86,29.97 | v42.38,13.21 42.89,12.7 v46.45,12.7 v48.73,12.7 49.75,13.72 49.75,15.49 52.3,18.07 52.3,25.93 THUMB.3 | 29.43,12.7 v32.4,12.7 | 29.43,12.7 22.78,12.7 THUMB_BUTTON.P$2 | v29.18,10.67 29.18,12.45 29.43,12.7
  Bottom 0.406: 40.86,26.67 v40.86,29.97 | 40.86,26.67 40.86,22.1 ICSP.4 | EXT.P$2 17.16,33.45 18.76,35.05 18.76,39.57 CALIB.P$2 | U$3.-1 1.49,11.43 3.52,9.4 11.4,9.4 16.6,4.19 16.6,2.06 U$1.GND | v32.4,12.7 32.4,19.38 30.19,21.59 30.19,23.62 33.49,26.92 40.61,26.92 40.86,26.67
  pour Top (isolate 0.406): 9.49,42.93 39.21,42.93 48.1,34.04 56.99,34.04 57.12,0.51 7.08,0.51 7.08,8.64 0.6,8.64 0.6,28.57 6.82,28.57 6.82,34.16 9.11,34.16
  pour Bottom (isolate 0.406): 9.62,42.93 39.34,42.93 48.23,34.04 57.12,34.04 57.24,0.51 7.21,0.51 7.21,8.64 0.73,8.64 0.73,28.57 6.95,28.57 6.95,34.16 9.24,34.16
N$1
  Top 0.813: PWRLED.- R8.2
N$2
  Top 0.406: C5.2 39.8,13.04 Y1.1 40.75,15.38 41.11,15.75 41.11,16.76 40.43,17.37 34.66,17.37 33.75,16.51 33.75,14.99 33.49,14.73 32.75,14.73 U1.8
N$3
  Top 0.406: C6.2 35.48,13.23 Y1.2 35.41,15.38 34,13.97 32.39,13.97 U1.7
N$4
  Top 0.406: D13.+ 24.71,27.28 R4.2
N$6  (via drill 0.6)
  Top 0.305: U$4.15 49.22,10.14 v49.75,10.67 | v49.75,5.59 49.75,5.18 50.26,4.67 USB.2
  Bottom 0.305: v49.75,10.67 v49.75,5.59
N$7
  Top 0.406: C3.2 23.4,20.7 U1.20
N$8
  Top 0.305: U$4.14 50.78,9.64 51.53,8.89 51.53,5.84 52.04,5.33 USB.3
N$11
  Top 0: 37.92,38.08 38.02,38.18 LOUT.P$2 38.02,38.05
  Top 0.305: D2.2 36.11,35.94 U$6.1 37.2,35.94 37.2,36.65 37.88,36.65 | 37.88,36.65 37.88,38.04 37.95,37.97 39.08,37.85 39.38,37.55 U$6.13 40.03,36.64 40.1,36.58 40.1,35.96 U$6.12 40.22,35.94 40.73,36.45 41.24,36.45 41.75,35.94 41.75,35.36 C_BST.2 | 37.88,36.65 U$6.16
  Top 0.406: 38.02,38.05 37.95,37.97 | 37.92,38.08 37.88,38.04
N$12
  Top 1.676: U$3.+ 7.71,27.3 12.16,31.75 25.87,31.75 28.92,28.7 30.11,28.7 PWR_SW.P$2
N$13
  Top 0.305: U$6.10 40.84,34.94 41.75,34.04 42.19,34.04 C_BST.1
N$14
  Top 1.016: INDEX.3 53.56,17.53 51.53,15.49 51.53,14.75 IND_PPTC.2
N$15
  Top 0.61: MIDDLE.3 53.7,23.98
  Top 1.016: 53.7,23.98 55.21,22.48 55.21,14.56 MID_PPTC.2
N$17
  Top 0.305: U$6.8 39.38,32.17 R_PRP.1
N$21
  Top 0.305: C9.1 41.37,6.86 42.13,7.62 43.42,7.62 U$4.31
N$24
  Top 0.406: USB.1 51.49,4.03 50.77,3.3 50.77,2.29 VBUS_PPTC.1
N$25
  Top 0.305: R5.1 45.18,11.4 U$4.22
N$27
  Top 0.305: R7.1 46,14.8 45.8,14.59 45.8,13.32 45.69,13.21 U$4.21
N$28
  Top 0.305: TX.- R5.2
N$29
  Top 0.305: R7.2 RX.-
RESET  (via drill 0.6)
  Top 0.406: U1.29 23.08,12.11 23.08,9.4 24.03,8.45 R6.1 31.05,8.45 RESET.2 31.46,8.92 31.46,10.67 31.72,10.92 v32.73,10.92 | C9.2 40.42,6.67 v39.34,5.59
  Bottom 0.406: ICSP.3 36.29,11.68 35.53,10.92 v32.73,10.92 32.73,7.11 33.49,6.35 36.29,6.35 37.05,5.59 v39.34,5.59
RX
  Top 0.305: U$4.30 42.63,8.14 42.38,8.38 42.38,9.53 R2.2
TX  (via drill 0.6)
  Top 0.305: R3.2 41.24,8.51 40.35,7.62 39.84,7.62 v39.34,7.11 | v44.67,5.08 44.67,6.37 U$4.2
  Bottom 0.305: v39.34,7.11 42.64,7.11 v44.67,5.08
V+  (via drill 0.5 pad 1.42)
  Top 0.305: U$6.5 37.88,33.34 38.19,33.02 38.19,32.47 R_PRP.2
  Top 0.406: LOUT.P$1 39.32,40.66 39.39,40.59
  Top 0.61: R_PRP.2 38.56,31.64 39.21,30.99 45.56,30.99 v46.07,30.48
  Top 1.422: MIDDLE.2 INDEX.2
  Top 1.524: THUMB.2 MIDDLE.2 | v46.07,30.48 46.07,33.78 39.39,40.59 C_OUT2.+ | C_OUT2.+ | C_OUT2.+ C_OUT1.+ | C_OUT2.+
  Bottom 1.524: v46.07,30.48 46.07,19.43 47.21,18.29 50.13,18.29 51.02,19.18 INDEX.2
VCC  (via drill 0.3 pad 0.25, 0.5 pad 1.42, 0.6 pad 1.42)
  Top 0.254: 36.54,35.31 37.18,35.31 U$6.2 U$6.3
  Top 0.305: U$6.11 40.74,35.44 v40.99,35.69 | 36.16,32.77 v36.54,31.62 | 36.16,32.77 CBYP3.2 | v35.91,29.21 35.91,30.67 CBYP4.2 35.46,32.07 36.16,32.77
  Top 0.508: CBYP3.2 35.65,33.91 35.4,34.16 36.54,35.31
  Top 1.27: U3.3 12.06,17.98 C1.+ 12.67,18.03 14.32,19.68 v14.57,19.68
  Bottom 0.305: v40.99,35.69 40.99,33.53 40.48,33.02 37.81,33.02 v36.54,31.62
  Bottom 1.27: 30.11,31.24 PWR_SW.P$3
  Bottom 1.676: v35.91,29.21 34.28,29.21 32.17,31.32 PWR_SW.P$3 29.26,31.32 27.91,29.97 27.91,24.38 24.35,20.83 15.71,20.83 v14.57,19.68
(copper drawn outside any net)
  shapes: Top area x6, Top circle x1

### Text on the board
tNames: PWR_SW | - + | SIG | VCC | GND | HandBoard Mk2 V4 | GND | 5V | SENS | A2 | A3 | SCL | SDA | RX | TX
bNames: HACKberry Hand Board Mk2 V4 / / Last Update : / 2017/9/4 / / Design : / Yuki Ogasawara, Mission ARM Japan / Hiroshi Yamaura, exiii Inc.